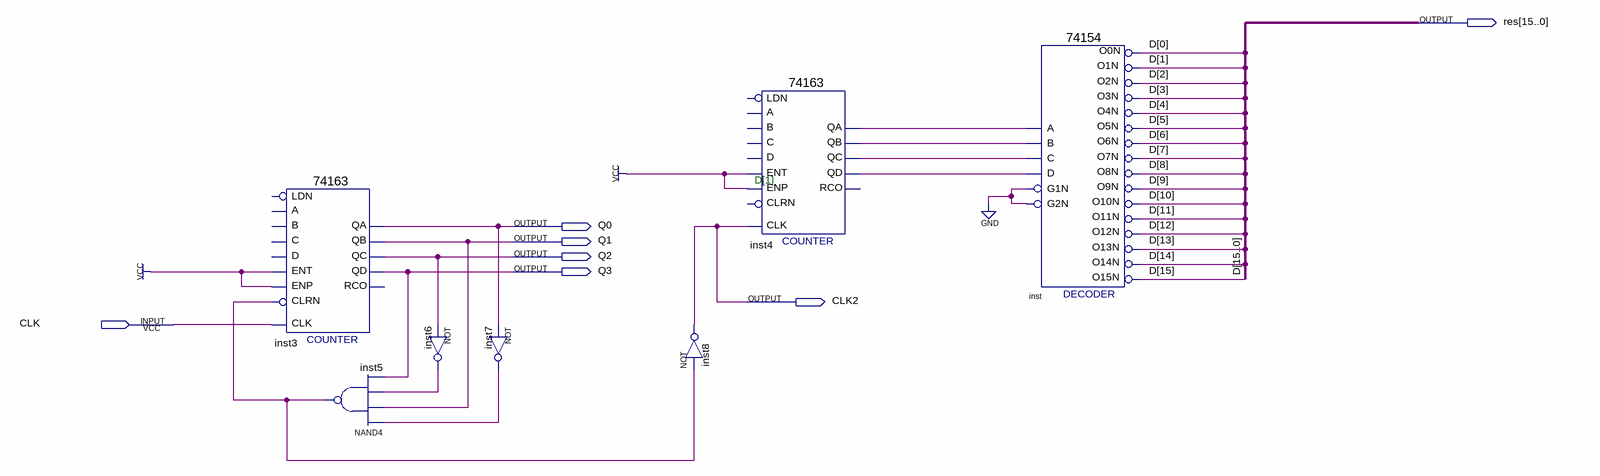
[diagram p0: schematic sheet]
// Quartus schematic task2.bdf as structural Verilog: 7 symbols, 7 pins
module task2 (
  input  CLK,
  output [15:0] res,
  output Q0,
  output Q1,
  output Q2,
  output Q3,
  output CLK2
);

  wire inst4_qa, inst4_qb, inst4_qc, inst4_qd, inst5_out, inst6_out, inst7_out;

  \74163  inst3 (
    .ENT(1'b1), .CLRN(inst5_out), .CLK(CLK), .ENP(1'b1), .QA(Q0), .QB(Q1), .QC(Q2), .QD(Q3));  // open: C, B, A, D, LDN, RCO
  nand inst5 (inst5_out, inst7_out, Q1, inst6_out, Q3);
  not inst6 (inst6_out, Q2);
  not inst7 (inst7_out, Q0);
  not inst8 (CLK2, inst5_out);
  \74163  inst4 (
    .ENT(1'b1), .CLK(CLK2), .ENP(1'b1), .QA(inst4_qa), .QB(inst4_qb), .QC(inst4_qc), .QD(inst4_qd));  // open: C, B, A, D, CLRN, LDN, RCO
  \74154  inst (
    .C(inst4_qc), .D(inst4_qd), .B(inst4_qb), .A(inst4_qa), .G1N(1'b0), .G2N(1'b0), .O0N(res[0]),
    .O12N(res[12]), .O15N(res[15]), .O10N(res[10]), .O11N(res[11]), .O1N(res[1]), .O13N(res[13]),
    .O14N(res[14]), .O4N(res[4]), .O3N(res[3]), .O2N(res[2]), .O7N(res[7]), .O6N(res[6]), .O5N(res[5]),
    .O9N(res[9]), .O8N(res[8]));

  // Other names for the same wires on the sheet: D[15:0] = res

  // Notes on the sheet:
  //   D[1]
endmodule
